# EAGLE schematic pavement_painter (EAGLE 9.1.3)
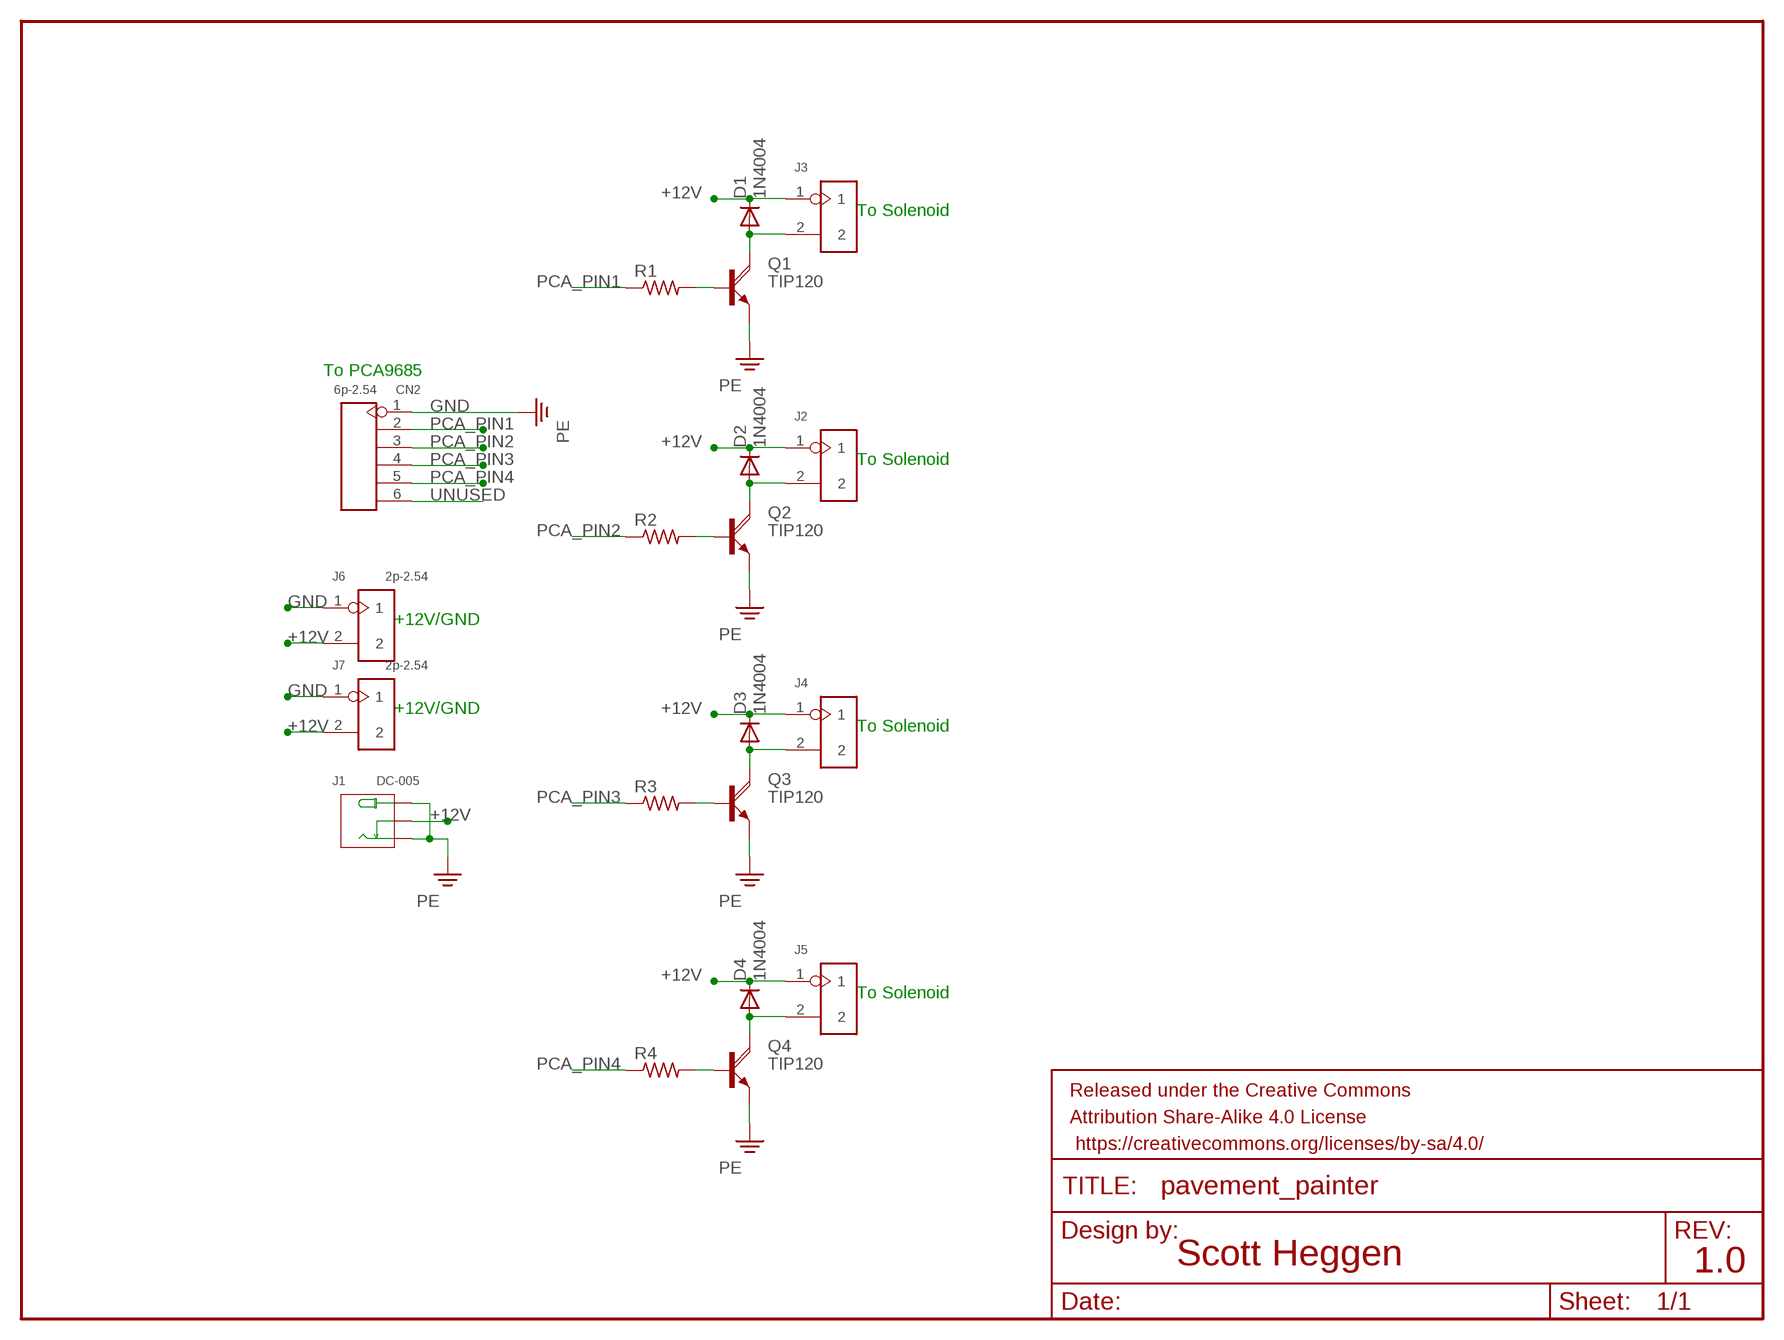
[diagram p0: schematic, sheet 1]

## Parts
CN2  6p-2.54  DIP-BLACK-FEMALE-HEADER-VERT(6P-2.54)  [H6-2.54]
D1  1N4004  [DO41-10]
D2  1N4004  [DO41-10]
D3  1N4004  [DO41-10]
D4  1N4004  [DO41-10]
FRAME1  FRAME-LETTER  [CREATIVE_COMMONS]
J1  DC-005  CONN-POWER-JACK-2.1MM(DC-005)  [DCJ3P-14.2X11.0X9.0MM]
J2  DIP-BLACK-JUMPER  [H2-2.54]
J3  DIP-BLACK-JUMPER  [H2-2.54]
J4  DIP-BLACK-JUMPER  [H2-2.54]
J5  DIP-BLACK-JUMPER  [H2-2.54]
J6  2p-2.54  DIP-BLACK-MALE-HEADER-VERT(2P-2.54)  [H2-2.54]
J7  2p-2.54  DIP-BLACK-MALE-HEADER-VERT(2P-2.54)  [H2-2.54]
Q1  TIP120  [TO220AH]
Q2  TIP120  [TO220AH]
Q3  TIP120  [TO220AH]
Q4  TIP120  [TO220AH]
R1  R-US_0207/12  [0207/12]
R2  R-US_0207/12  [0207/12]
R3  R-US_0207/12  [0207/12]
R4  R-US_0207/12  [0207/12]

## Nets
+12V: D1.C D2.C D3.C D4.C J1.-2(CDN) J2.1 J3.1 J4.1 J5.1 J6.2 J7.2
GND: CN2.1 J1.+ J1.-1(-) J6.1 J7.1 Q1.E Q2.E Q3.E Q4.E ; supply symbol labelled PE
N$1: D2.A J2.2 Q2.C
N$2: Q2.B R2.2
N$3: D1.A J3.2 Q1.C
N$4: Q1.B R1.2
N$5: D3.A J4.2 Q3.C
N$6: Q3.B R3.2
N$7: D4.A J5.2 Q4.C
N$8: Q4.B R4.2
PCA_PIN1: CN2.2 R1.1
PCA_PIN2: CN2.3 R2.1
PCA_PIN3: CN2.4 R3.1
PCA_PIN4: CN2.5 R4.1
UNUSED: CN2.6

## Notes on the sheet
- To Solenoid
- To PCA9685
- To Solenoid
- +12V/GND
- +12V/GND
- To Solenoid
- To Solenoid
- Scott Heggen | 1.0

## Library data of the parts
CN2 = Seeed-Connector:DIP-BLACK-FEMALE-HEADER-VERT(6P-2.54): 320030060; MPN: F185-1106A1BSYC1
D1-D4 = adafruit:1N4004: DIODE General purpose 1N400x type rectifier (With bigger pads) http://www.ladyada.net/library/pcb/eaglelibrary.html
FRAME1 = SparkFun-Aesthetics:FRAME-LETTER: Schematic Frame - Letter Standard 8.5x11 US Letter frame
J1 = Seeed-Connector:CONN-POWER-JACK-2.1MM(DC-005): 320120003; MPN: DC-005
J2-J5 = Seeed-Connector:DIP-BLACK-JUMPER: 320190003
J6 J7 = Seeed-Connector:DIP-BLACK-MALE-HEADER-VERT(2P-2.54): 320020016; MPN: P125-1102A0BS116A1
Q1-Q4 = transistor-power:TIP120: NPN DARLINGTON TRANSISTOR
R1-R4 = rcl:R-US_: RESISTOR, American symbol; SPICEPREFIX: R